# Altium project BytePipe_x9002_HDK_Release_Rev2.PrjPcb (part 1 of 2)
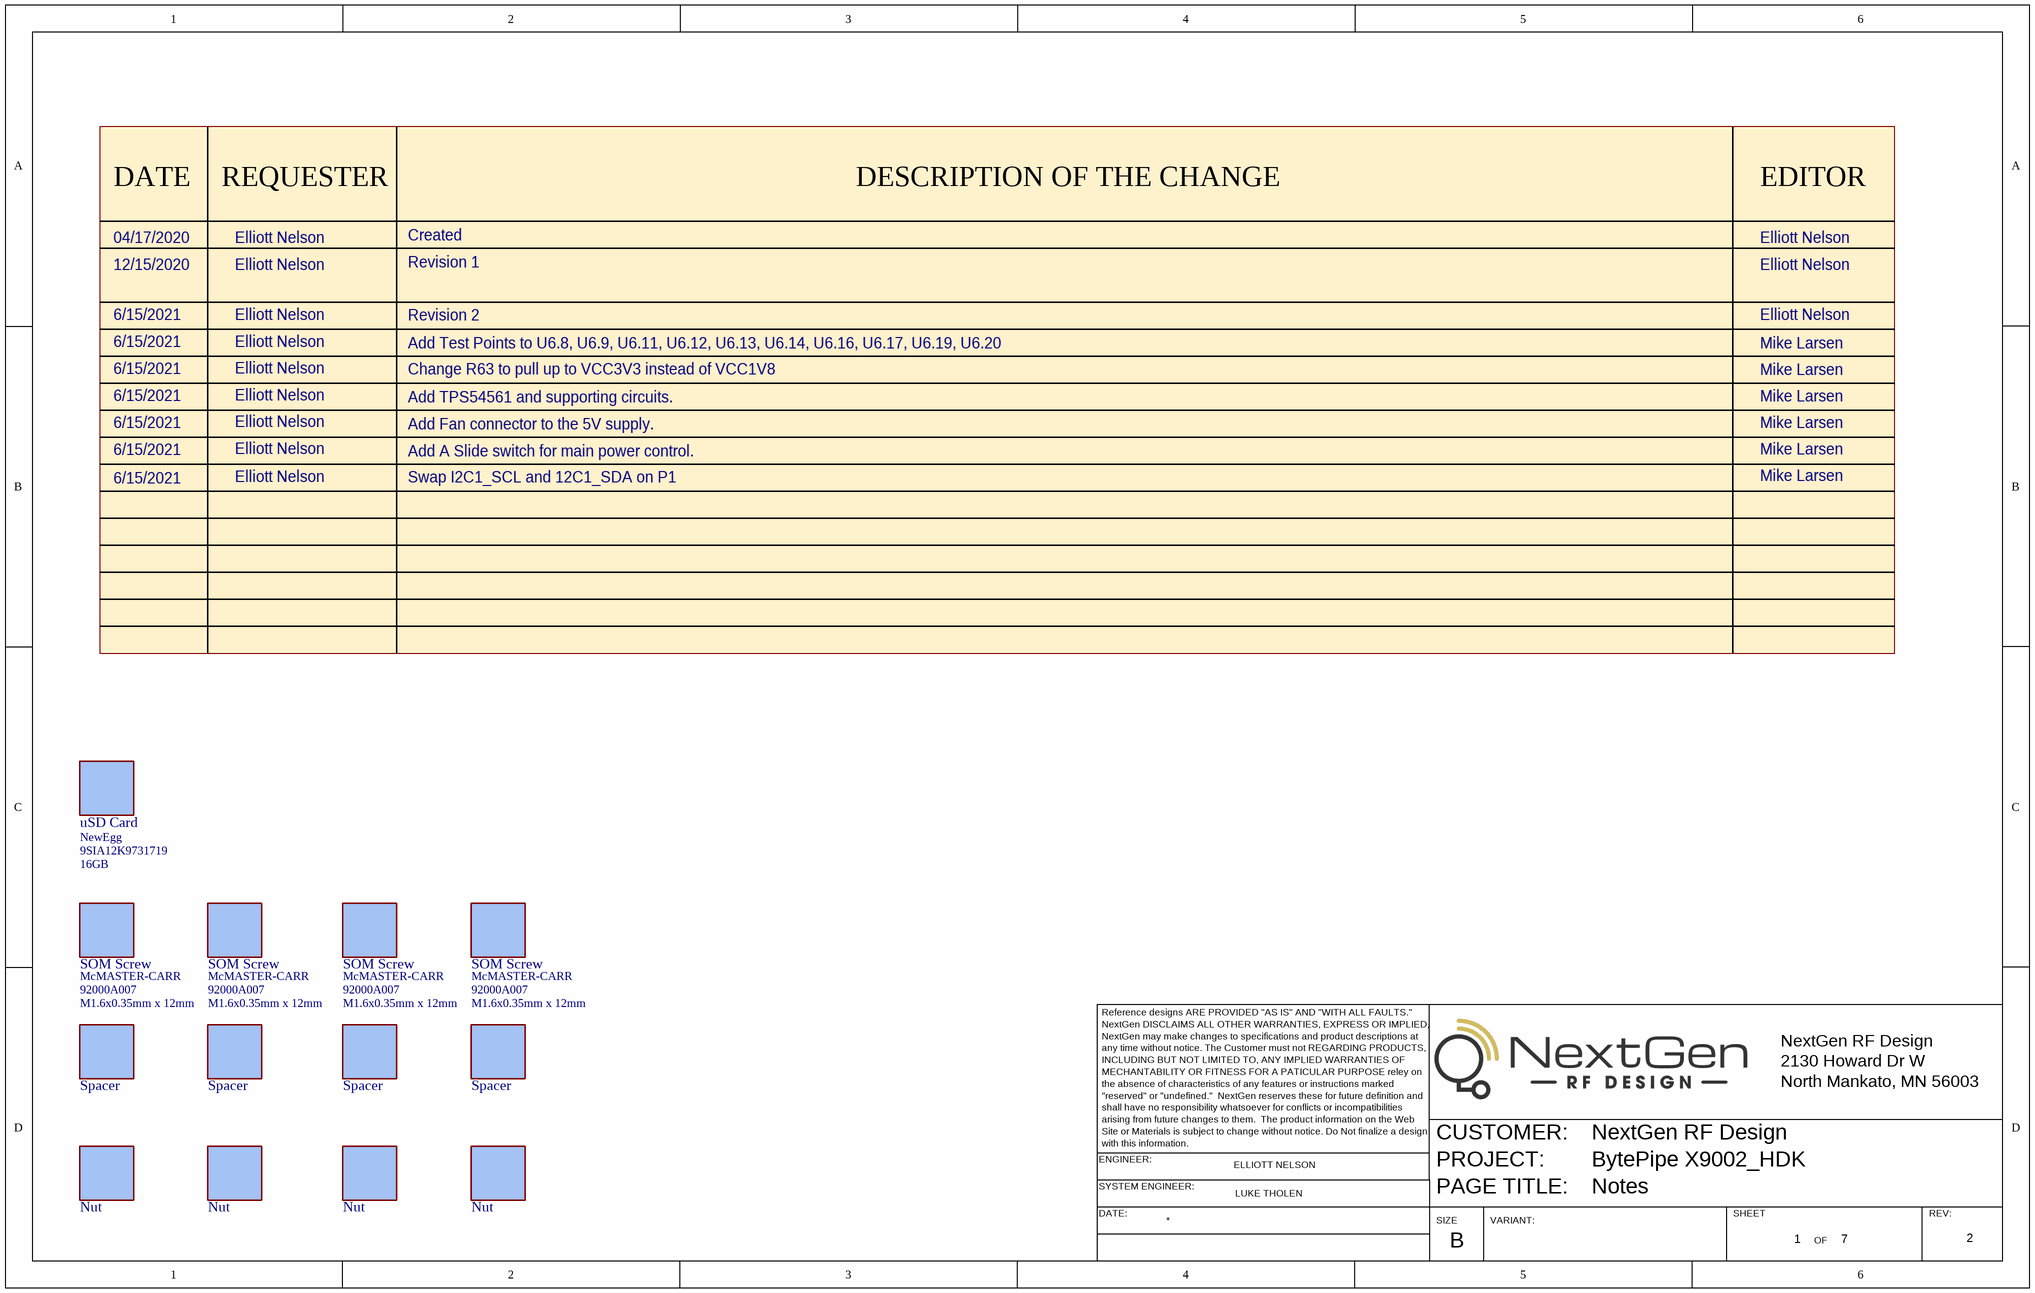
[diagram p0: 1-Notes.SchDoc]
=Engineer: ELLIIOTT NELSON
7 sheets, 318 parts. Net scope: flat (ports and power ports of the same name join across sheets).
Board file: BytePipe_x9002_HDK_Rev2.PcbDoc
Sheets:
  1-Notes.SchDoc
  2-SOM Interface.SchDoc
  3-RF Frontend.SchDoc
  4-USB & SATA.SchDoc
  5-DisplayPort & Ethernet.SchDoc
  6-User IO.SchDoc
  7-JTAG & Power.SchDoc

## Sheet 1-Notes.SchDoc: Notes
size B; CompanyName: NextGen RF Design; Address1: 2130 Howard Drive W; Address2: North Mankato, MN 56003; Address3: www.nextgenrf.com; Revision: 2; SheetNumber: 1; SheetTotal: 7; ProjName: BytePipe X9002_HDK

### Parts
B1  uSD Card  value 16GB  OEM NAME: NewEgg  OEM#: 9SIA12K9731719
B2  SOM Screw  value M1.6x0.35mm x 12mm  OEM NAME: McMASTER-CARR  OEM#: 92000A007
B9  SOM Screw  value M1.6x0.35mm x 12mm  OEM NAME: McMASTER-CARR  OEM#: 92000A007
B10  SOM Screw  value M1.6x0.35mm x 12mm  OEM NAME: McMASTER-CARR  OEM#: 92000A007
B11  SOM Screw  value M1.6x0.35mm x 12mm  OEM NAME: McMASTER-CARR  OEM#: 92000A007
B12  Spacer
B13  Spacer
B14  Spacer
B15  Spacer
B20  Nut
B21  Nut
B22  Nut
B23  Nut

### Notes on the sheet
- DATE
- REQUESTER
- Created
- DESCRIPTION OF THE CHANGE
- EDITOR
- 04/17/2020
- 12/15/2020
- Elliott Nelson
- Revision 1
- 6/15/2021
- Add Test Points to U6.8, U6.9, U6.11, U6.12, U6.13, U6.14, U6.16, U6.17, U6.19, U6.20
- Change R63 to pull up to VCC3V3 instead of VCC1V8
- Revision 2
- Mike Larsen
- Add TPS54561 and supporting circuits.
- Add Fan connector to the 5V supply.
- Swap I2C1_SCL and 12C1_SDA on P1
- Add A Slide switch for main power control.
- Reference designs ARE PROVIDED "AS IS" AND "WITH ALL FAULTS."
- NextGen DISCLAIMS ALL OTHER WARRANTIES, EXPRESS OR IMPLIED,
- NextGen may make changes to specifications and product descriptions at
- NextGen RF Design
- any time without notice. The Customer must not REGARDING PRODUCTS,
- INCLUDING BUT NOT LIMITED TO, ANY IMPLIED WARRANTIES OF
- MECHANTABILITY OR FITNESS FOR A PATICULAR PURPOSE reley on
- "reserved" or "undefined."  NextGen reserves these for future definition and
- the absence of characteristics of any features or instructions marked
- shall have no responsibility whatsoever for conflicts or incompatibilities
- 2130 Howard Dr W
- North Mankato, MN 56003
- ENGINEER:
- Site or Materials is subject to change without notice. Do Not finalize a design
- with this information.
- arising from future changes to them.  The product information on the Web
- ELLIOTT NELSON
- CUSTOMER:
- PROJECT:
- SYSTEM ENGINEER:
- DATE:
- LUKE THOLEN
- SIZE
- PAGE TITLE:
- VARIANT:
- SHEET
- OF
- REV:
- B

### Library data of the parts
B1 = BOM_COMPONENT_NO-FOOTPRINT: 16GB Micro SD Memory Card Class 10 80MB/s Storage Device- BLACK
B2 B9-B15 B20-B23 = BOM_COMPONENT_NO-FOOTPRINT

## Sheet 2-SOM Interface.SchDoc: SOM Interface
size B; CompanyName: NextGen RF Design; Address1: 2130 Howard Drive W; Address2: North Mankato, MN 56003; Address3: www.nextgenrf.com; Revision: 2; SheetNumber: 2; SheetTotal: 7; ProjName: BytePipe X9002_HDK
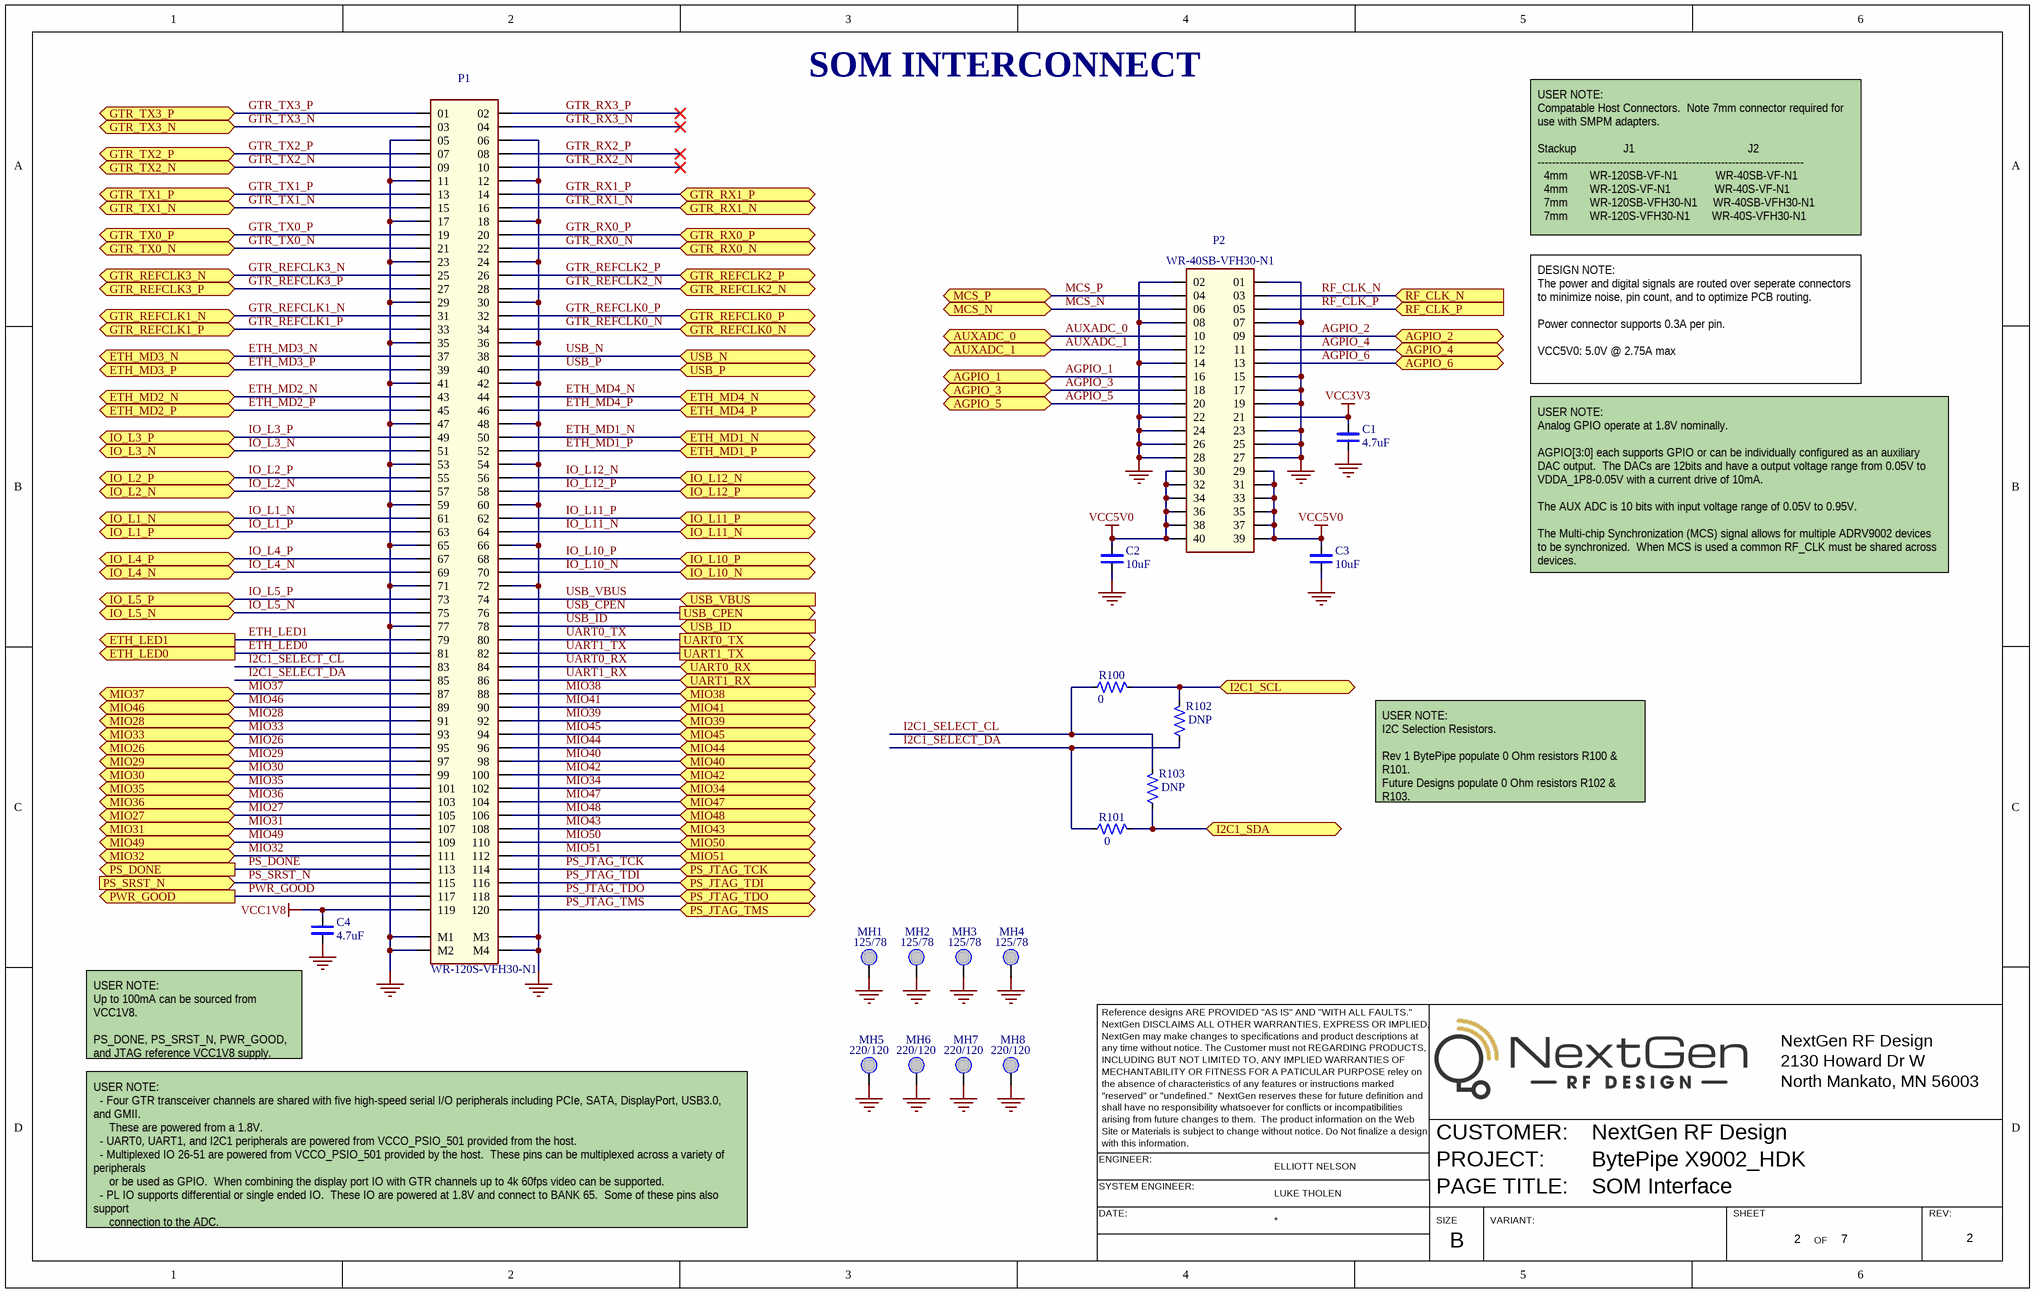
[diagram p1: 2-SOM Interface.SchDoc]

### Parts
C1  value 4.7uF  [SM/0402/CAP]  (hidden comment: CAP_CERAMIC_0402)
C2  value 10uF  [SM/0402/CAP]  (hidden comment: CAP_CERAMIC_0402)
C3  value 10uF  [SM/0402/CAP]  (hidden comment: CAP_CERAMIC_0402)
C4  value 4.7uF  [SM/0402/CAP]  (hidden comment: CAP_CERAMIC_0402)
MH1  HOLE_PTH_125/78  [MTG125/78]  (value not drawn)  (no BOM)
MH2  HOLE_PTH_125/78  [MTG125/78]  (value not drawn)  (no BOM)
MH3  HOLE_PTH_125/78  [MTG125/78]  (value not drawn)  (no BOM)
MH4  HOLE_PTH_125/78  [MTG125/78]  (value not drawn)  (no BOM)
MH5  HOLE_PTH_220/120  [MTG220/120]  (value not drawn)  (no BOM)
MH6  HOLE_PTH_220/120  [MTG220/120]  (value not drawn)  (no BOM)
MH7  HOLE_PTH_220/120  [MTG220/120]  (value not drawn)  (no BOM)
MH8  HOLE_PTH_220/120  [MTG220/120]  (value not drawn)  (no BOM)
P1  value WR-120S-VFH30-N1  [SM/CON/JAE/WR-120S-VFH30-N1]  (hidden comment: WR-120S-VFH30-N1‎)
P2  value WR-40SB-VFH30-N1  [SM/CON/JAE/WR-40SB-VFH30-N1]  (hidden comment: WR-40SB-VFH30-N1‎)
R100  value 0  [SM/0402/RES]  (hidden comment: RES_0402_A)
R101  value 0  [SM/0402/RES]  (hidden comment: RES_0402_A)
R102  value DNP  [SM/0402/RES]  (hidden comment: RES_0402_A)
R103  value DNP  [SM/0402/RES]  (hidden comment: RES_0402_A)

### Ports
AGPIO_1 (bidir), AGPIO_2 (bidir), AGPIO_3 (bidir), AGPIO_4 (bidir), AGPIO_5 (bidir), AGPIO_6 (bidir), AUXADC_0 (bidir), AUXADC_1 (bidir), ETH_LED0 (out), ETH_LED1 (out), ETH_MD1_N (bidir), ETH_MD1_P (bidir), ETH_MD2_N (bidir), ETH_MD2_P (bidir), ETH_MD3_N (bidir), ETH_MD3_P (bidir), ETH_MD4_N (bidir), ETH_MD4_P (bidir), GTR_REFCLK0_N (bidir), GTR_REFCLK0_P (bidir), GTR_REFCLK1_N (bidir), GTR_REFCLK1_P (bidir), GTR_REFCLK2_N (bidir), GTR_REFCLK2_P (bidir), GTR_REFCLK3_N (bidir), GTR_REFCLK3_P (bidir), GTR_RX0_N (bidir), GTR_RX0_P (bidir), GTR_RX1_N (bidir), GTR_RX1_P (bidir), GTR_TX0_N (bidir), GTR_TX0_P (bidir), GTR_TX1_N (bidir), GTR_TX1_P (bidir), GTR_TX2_N (bidir), GTR_TX2_P (bidir), GTR_TX3_N (bidir), GTR_TX3_P (bidir), I2C1_SCL (bidir), I2C1_SDA (bidir), IO_L1_N (bidir), IO_L1_P (bidir), IO_L2_N (bidir), IO_L2_P (bidir), IO_L3_N (bidir), IO_L3_P (bidir), IO_L4_N (bidir), IO_L4_P (bidir), IO_L5_N (bidir), IO_L5_P (bidir), IO_L10_N (bidir), IO_L10_P (bidir), IO_L11_N (bidir), IO_L11_P (bidir), IO_L12_N (bidir), IO_L12_P (bidir), MCS_N (bidir), MCS_P (bidir), MIO26 (bidir), MIO27 (bidir), MIO28 (bidir), MIO29 (bidir), MIO30 (bidir), MIO31 (bidir), MIO32 (bidir), MIO33 (bidir), MIO34 (bidir), MIO35 (bidir), MIO36 (bidir), MIO37 (bidir), MIO38 (bidir), MIO39 (bidir), MIO40 (bidir), MIO41 (bidir), MIO42 (bidir), MIO43 (bidir), MIO44 (bidir), MIO45 (bidir), MIO46 (bidir), MIO47 (bidir), MIO48 (bidir), MIO49 (bidir), MIO50 (bidir), MIO51 (bidir), PS_DONE (out), PS_JTAG_TCK (bidir), PS_JTAG_TDI (bidir), PS_JTAG_TDO (bidir), PS_JTAG_TMS (bidir), PS_SRST_N (in), PWR_GOOD (out), RF_CLK_N (in), RF_CLK_P (in), UART0_RX (in), UART0_TX (out), UART1_RX (in), UART1_TX (out), USB_CPEN (out), USB_ID (in), USB_N (bidir), USB_P (bidir), USB_VBUS (in)

### Nets
GND: C1.2(N2) C2.2(N2) C3.2(N2) C4.2(N2) MH1.1(N1) MH2.1(N1) MH3.1(N1) MH4.1(N1) MH5.1(N1) MH6.1(N1) MH7.1(N1) MH8.1(N1) P1.05 P1.06 P1.11 P1.12 P1.17 P1.18 P1.23 P1.24 P1.29 P1.30 P1.35 P1.36 P1.41 P1.42 P1.47 P1.48 P1.53 P1.54 P1.59 P1.60 P1.65 P1.66 P1.71 P1.72 P1.77 P1.M1 P1.M2 P1.M3 P1.M4 P2.01 P2.02 P2.07 P2.08 P2.14 P2.15 P2.17 P2.19 P2.22 P2.23 P2.24 P2.25 P2.26 P2.27 P2.28
VCC1V8: C4.1(N1) P1.119
VCC3V3: C1.1(N1) P2.21
VCC5V0: C2.1(N1) C3.1(N1) P2.29 P2.30 P2.31 P2.32 P2.33 P2.34 P2.35 P2.36 P2.37 P2.38 P2.39 P2.40
AGPIO_1: P2.16 ; port AGPIO_1
AGPIO_2: P2.09 ; port AGPIO_2
AGPIO_3: P2.18 ; port AGPIO_3
AGPIO_4: P2.11 ; port AGPIO_4
AGPIO_5: P2.20 ; port AGPIO_5
AGPIO_6: P2.13 ; port AGPIO_6
AUXADC_0: P2.10 ; port AUXADC_0
AUXADC_1: P2.12 ; port AUXADC_1
ETH_LED0: P1.81 ; port ETH_LED0
ETH_LED1: P1.79 ; port ETH_LED1
ETH_MD1_N: P1.50 ; port ETH_MD1_N
ETH_MD1_P: P1.52 ; port ETH_MD1_P
ETH_MD2_N: P1.43 ; port ETH_MD2_N
ETH_MD2_P: P1.45 ; port ETH_MD2_P
ETH_MD3_N: P1.37 ; port ETH_MD3_N
ETH_MD3_P: P1.39 ; port ETH_MD3_P
ETH_MD4_N: P1.44 ; port ETH_MD4_N
ETH_MD4_P: P1.46 ; port ETH_MD4_P
GTR_REFCLK0_N: P1.34 ; port GTR_REFCLK0_N
GTR_REFCLK0_P: P1.32 ; port GTR_REFCLK0_P
GTR_REFCLK1_N: P1.31 ; port GTR_REFCLK1_N
GTR_REFCLK1_P: P1.33 ; port GTR_REFCLK1_P
GTR_REFCLK2_N: P1.28 ; port GTR_REFCLK2_N
GTR_REFCLK2_P: P1.26 ; port GTR_REFCLK2_P
GTR_REFCLK3_N: P1.25 ; port GTR_REFCLK3_N
GTR_REFCLK3_P: P1.27 ; port GTR_REFCLK3_P
GTR_RX0_N: P1.22 ; port GTR_RX0_N
GTR_RX0_P: P1.20 ; port GTR_RX0_P
GTR_RX1_N: P1.16 ; port GTR_RX1_N
GTR_RX1_P: P1.14 ; port GTR_RX1_P
GTR_RX2_N: P1.10
GTR_RX2_P: P1.08
GTR_RX3_N: P1.04
GTR_RX3_P: P1.02
GTR_TX0_N: P1.21 ; port GTR_TX0_N
GTR_TX0_P: P1.19 ; port GTR_TX0_P
GTR_TX1_N: P1.15 ; port GTR_TX1_N
GTR_TX1_P: P1.13 ; port GTR_TX1_P
GTR_TX2_N: P1.09 ; port GTR_TX2_N
GTR_TX2_P: P1.07 ; port GTR_TX2_P
GTR_TX3_N: P1.03 ; port GTR_TX3_N
GTR_TX3_P: P1.01 ; port GTR_TX3_P
I2C1_SCL: R100.1 R102.1 ; port I2C1_SCL
I2C1_SDA: R101.1 R103.2 ; port I2C1_SDA
I2C1_SELECT_CL: P1.83 R100.2 R103.1
I2C1_SELECT_DA: P1.85 R101.2 R102.2
IO_L1_N: P1.61 ; port IO_L1_N
IO_L1_P: P1.63 ; port IO_L1_P
IO_L2_N: P1.57 ; port IO_L2_N
IO_L2_P: P1.55 ; port IO_L2_P
IO_L3_N: P1.51 ; port IO_L3_N
IO_L3_P: P1.49 ; port IO_L3_P
IO_L4_N: P1.69 ; port IO_L4_N
IO_L4_P: P1.67 ; port IO_L4_P
IO_L5_N: P1.75 ; port IO_L5_N
IO_L5_P: P1.73 ; port IO_L5_P
IO_L10_N: P1.70 ; port IO_L10_N
IO_L10_P: P1.68 ; port IO_L10_P
IO_L11_N: P1.64 ; port IO_L11_N
IO_L11_P: P1.62 ; port IO_L11_P
IO_L12_N: P1.56 ; port IO_L12_N
IO_L12_P: P1.58 ; port IO_L12_P
MCS_N: P2.06 ; port MCS_N
MCS_P: P2.04 ; port MCS_P
MIO26: P1.95 ; port MIO26
MIO27: P1.105 ; port MIO27
MIO28: P1.91 ; port MIO28
MIO29: P1.97 ; port MIO29
MIO30: P1.99 ; port MIO30
MIO31: P1.107 ; port MIO31
MIO32: P1.111 ; port MIO32
MIO33: P1.93 ; port MIO33
MIO34: P1.102 ; port MIO34
MIO35: P1.101 ; port MIO35
MIO36: P1.103 ; port MIO36
MIO37: P1.87 ; port MIO37
MIO38: P1.88 ; port MIO38
MIO39: P1.92 ; port MIO39
MIO40: P1.98 ; port MIO40
MIO41: P1.90 ; port MIO41
MIO42: P1.100 ; port MIO42
MIO43: P1.108 ; port MIO43
MIO44: P1.96 ; port MIO44
MIO45: P1.94 ; port MIO45
MIO46: P1.89 ; port MIO46
MIO47: P1.104 ; port MIO47
MIO48: P1.106 ; port MIO48
MIO49: P1.109 ; port MIO49
MIO50: P1.110 ; port MIO50
MIO51: P1.112 ; port MIO51
PS_DONE: P1.113 ; port PS_DONE
PS_JTAG_TCK: P1.114 ; port PS_JTAG_TCK
PS_JTAG_TDI: P1.116 ; port PS_JTAG_TDI
PS_JTAG_TDO: P1.118 ; port PS_JTAG_TDO
PS_JTAG_TMS: P1.120 ; port PS_JTAG_TMS
PS_SRST_N: P1.115 ; port PS_SRST_N
PWR_GOOD: P1.117 ; port PWR_GOOD
RF_CLK_N: P2.03 ; port RF_CLK_N
RF_CLK_P: P2.05 ; port RF_CLK_P
UART0_RX: P1.84 ; port UART0_RX
UART0_TX: P1.80 ; port UART0_TX
UART1_RX: P1.86 ; port UART1_RX
UART1_TX: P1.82 ; port UART1_TX
USB_CPEN: P1.76 ; port USB_CPEN
USB_ID: P1.78 ; port USB_ID
USB_N: P1.38 ; port USB_N
USB_P: P1.40 ; port USB_P
USB_VBUS: P1.74 ; port USB_VBUS

### Notes on the sheet
- SOM INTERCONNECT
- USER NOTE:
  Compatable Host Connectors.  Note 7mm connector required for use with SMPM adapters.
  Stackup               J1                                    J2
  --------------------------------------------------------------------------
  4mm       WR-120SB-VF-N1            WR-40SB-VF-N1
  4mm       WR-120S-VF-N1              WR-40S-VF-N1
  7mm       WR-120SB-VFH30-N1     WR-40SB-VFH30-N1
  7mm       WR-120S-VFH30-N1       WR-40S-VFH30-N1
- DESIGN NOTE:
  The power and digital signals are routed over seperate connectors to minimize noise, pin count, and to optimize PCB routing.
  Power connector supports 0.3A per pin.
  VCC5V0: 5.0V @ 2.75A max
- USER NOTE:
  Analog GPIO operate at 1.8V nominally.
  AGPIO[3:0] each supports GPIO or can be individually configured as an auxiliary DAC output.  The DACs are 12bits and have a output voltage range from 0.05V to VDDA_1P8-0.05V with a current drive of 10mA.
  The AUX ADC is 10 bits with input voltage range of 0.05V to 0.95V.
  The Multi-chip Synchronization (MCS) signal allows for multiple ADRV9002 devices to be synchronized.  When MCS is used a common RF_CLK must be shared across devices.
- USER NOTE:
  I2C Selection Resistors.
  Rev 1 BytePipe populate 0 Ohm resistors R100 & R101.
  Future Designs populate 0 Ohm resistors R102 & R103.
- Reference designs ARE PROVIDED "AS IS" AND "WITH ALL FAULTS."
- NextGen DISCLAIMS ALL OTHER WARRANTIES, EXPRESS OR IMPLIED,
- NextGen may make changes to specifications and product descriptions at
- NextGen RF Design
- (near C4) USER NOTE:
  Up to 100mA can be sourced from VCC1V8.
  PS_DONE, PS_SRST_N, PWR_GOOD, and JTAG reference VCC1V8 supply.
- any time without notice. The Customer must not REGARDING PRODUCTS,
- INCLUDING BUT NOT LIMITED TO, ANY IMPLIED WARRANTIES OF
- MECHANTABILITY OR FITNESS FOR A PATICULAR PURPOSE reley on
- "reserved" or "undefined."  NextGen reserves these for future definition and
- the absence of characteristics of any features or instructions marked
- shall have no responsibility whatsoever for conflicts or incompatibilities
- 2130 Howard Dr W
- North Mankato, MN 56003
- ENGINEER:
- Site or Materials is subject to change without notice. Do Not finalize a design
- with this information.
- arising from future changes to them.  The product information on the Web
- ELLIOTT NELSON
- CUSTOMER:
- PROJECT:
- USER NOTE:
  - Four GTR transceiver channels are shared with five high-speed serial I/O peripherals including PCIe, SATA, DisplayPort, USB3.0, and GMII.
  These are powered from a 1.8V.
  - UART0, UART1, and I2C1 peripherals are powered from VCCO_PSIO_501 provided from the host.
  - Multiplexed IO 26-51 are powered from VCCO_PSIO_501 provided by the host.  These pins can be multiplexed across a variety of peripherals
  or be used as GPIO.  When combining the display port IO with GTR channels up to 4k 60fps video can be supported.
  - PL IO supports differential or single ended IO.  These IO are powered at 1.8V and connect to BANK 65.  Some of these pins also support
  connection to the ADC.
  - USB OTG signals support USB2.0 host or device.  They can be combined with GTR channels to support USB 3.0.
- SYSTEM ENGINEER:
- DATE:
- LUKE THOLEN
- SIZE
- PAGE TITLE:
- VARIANT:
- SHEET
- OF
- REV:
- B
- (in symbol HOLE_PTH_125/78) 125/78
- (in symbol HOLE_PTH_220/120) 220/120

### Library data of the parts
C1 C4 = CAP_CERAMIC_0402: CAP CER 4.7UF 10V X5R 0402; TOL: ±20%; OEM#: CL05A475MP5NRNC; OEM NAME: Samsung; VOLT: 10V
C2 C3 = CAP_CERAMIC_0402: 10µF ±20% 10V Ceramic Capacitor X5R 0402 (1005 Metric); OEM#: CL05A106MP8NUB8; OEM NAME: Samsung; TOL: ±20%; VOLT: 10V
MH1-MH4 = HOLE_PTH_125/78: 125 mil pad / 78 mil hole
MH5-MH8 = HOLE_PTH_220/120: 220 mil pad / 120 mil hole (#4 Pan Head Screw)
P1 = CON_JAE_WR-120S-VFH30-N1: 0.5 mm pitch, 120 Position Connector Receptacle, Center Strip Contacts Surface Mount Gold.; OEM NAME: JAE; OEM#: WR-120S-VFH30-N1
P2 = CON_JAE_WR-40SB-VFH30-N1: 0.5 mm pitch, 40 Position Connector Receptacle, Center Strip Contacts Surface Mount Gold, with Alignment Pins.; OEM NAME: JAE; OEM#: WR-40SB-VFH30-N1
R100 R101 = RES_0402_A: RES SMD 0 OHM JUMPER 1/10W 0402; OEM#: ERJ-2GE0R00X; OEM NAME: Panasonic; TOL: 1%
R102 R103 = RES_0402_A: DNP; OEM#: DNP

## Sheet 3-RF Frontend.SchDoc: RF Frontend
size B; CompanyName: NGRF; Address1: 2130 Howard Drive W; Address2: North Mankato, MN 56003; Address3: www.nextgenrf.com; Revision: 2; SheetNumber: 3; SheetTotal: 7; ProjName: BytePipe X9002_HDK
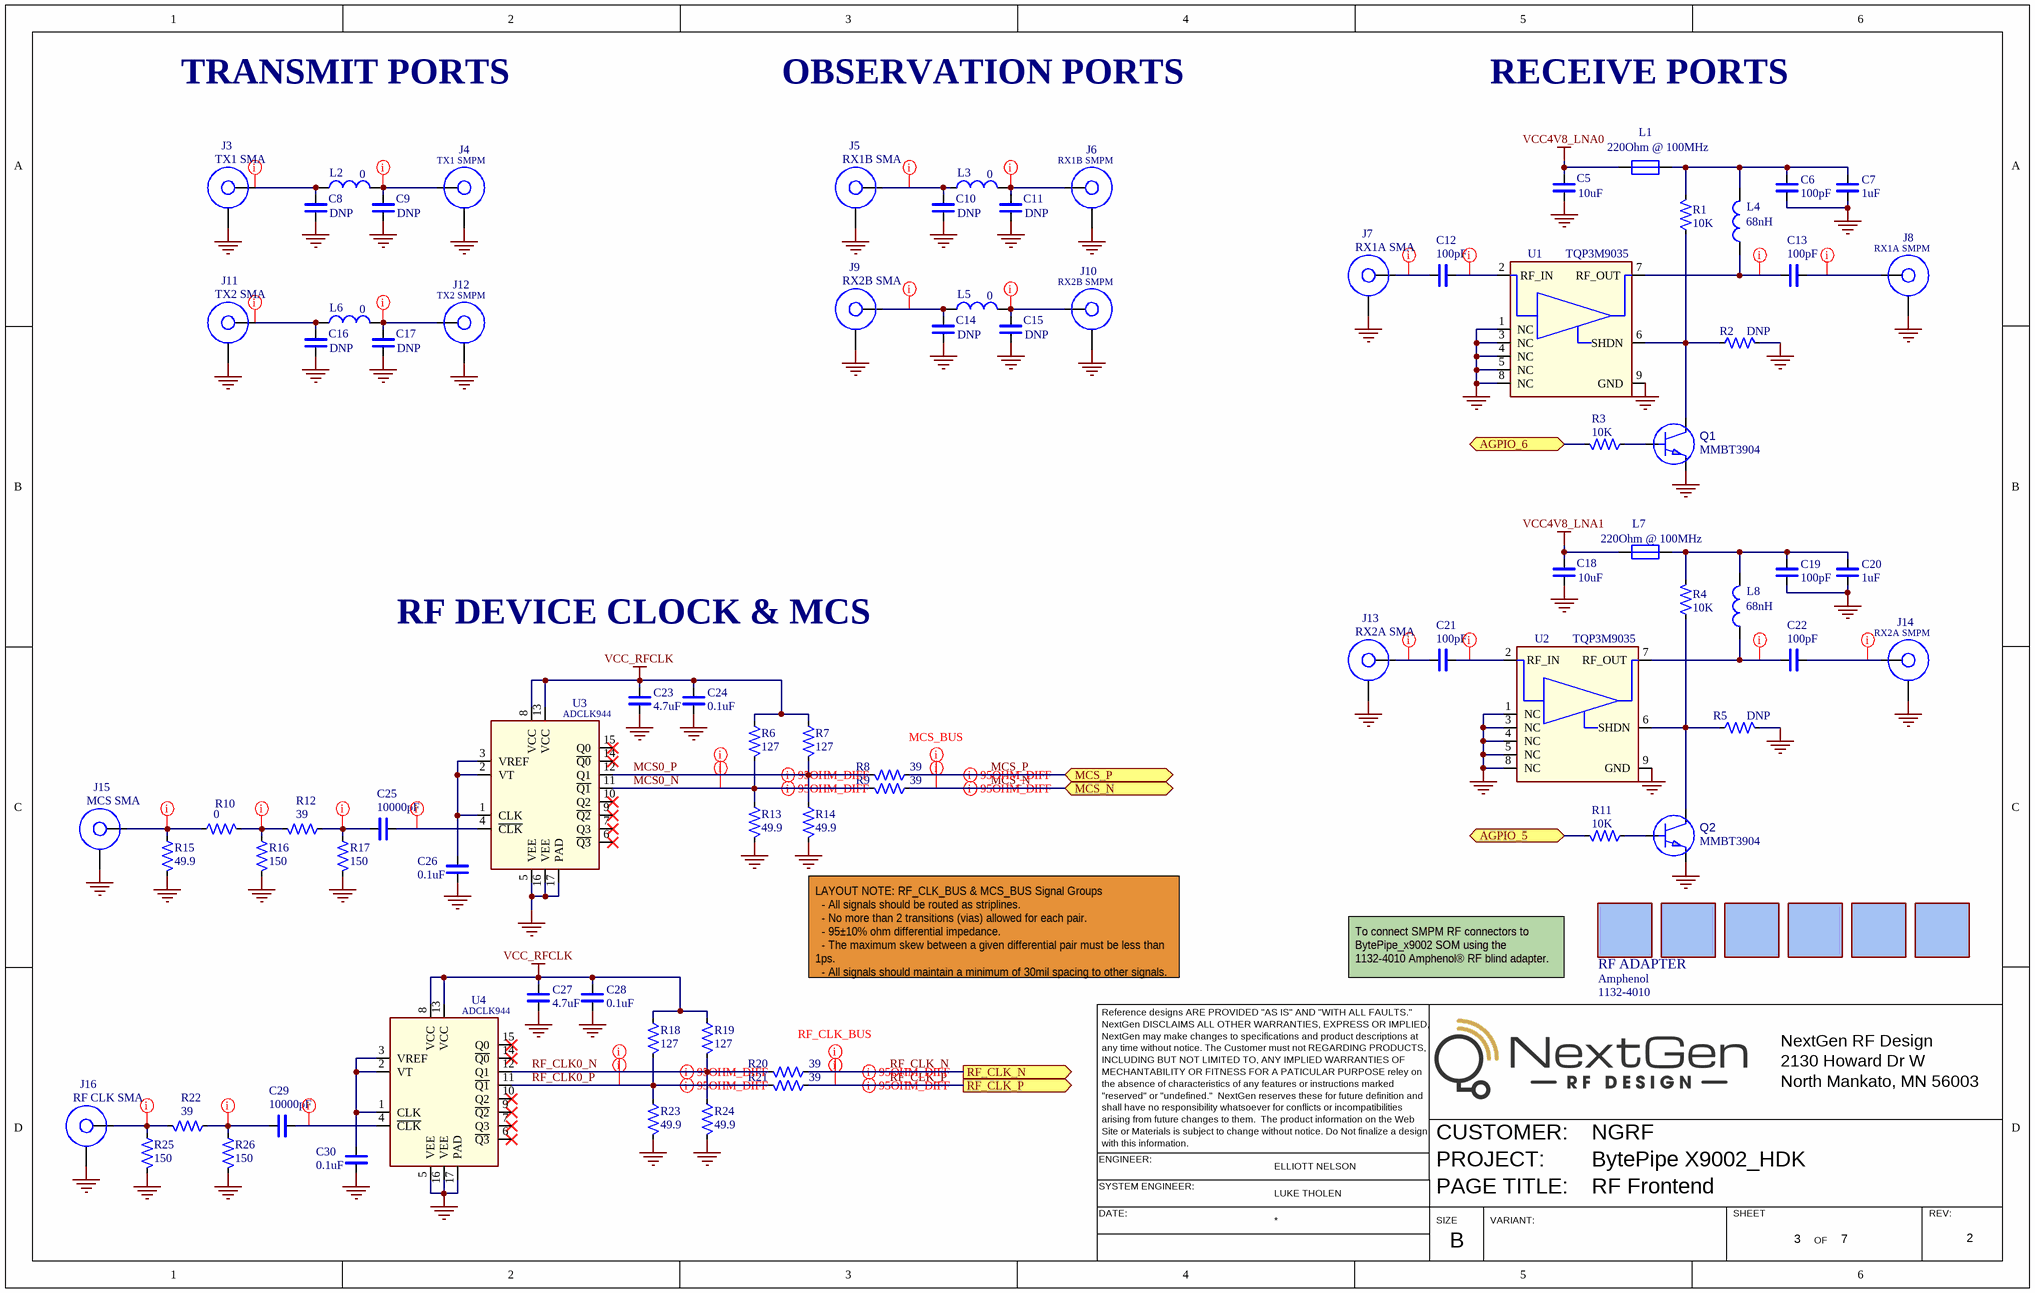
[diagram p2: 3-RF Frontend.SchDoc]

### Parts
B3  RF ADAPTER  OEM NAME: Amphenol  OEM#: 1132-4010
B4  RF ADAPTER  (value not drawn)
B5  RF ADAPTER  (value not drawn)
B6  RF ADAPTER  (value not drawn)
B7  RF ADAPTER  (value not drawn)
B8  RF ADAPTER  (value not drawn)
C5  value 10uF  [SM/0402/CAP]  (hidden comment: CAP_CERAMIC_0402)
C6  value 100pF  [SM/0402/CAP]  (hidden comment: CAP_CERAMIC_0402)
C7  value 1uF  [SM/0402/CAP]  (hidden comment: CAP_CERAMIC_0402)
C8  value DNP  [SM/0402/CAP]  (hidden comment: CAP_CERAMIC_0402)
C9  value DNP  [SM/0402/CAP]  (hidden comment: CAP_CERAMIC_0402)
C10  value DNP  [SM/0402/CAP]  (hidden comment: CAP_CERAMIC_0402)
C11  value DNP  [SM/0402/CAP]  (hidden comment: CAP_CERAMIC_0402)
C12  value 100pF  [SM/0402/CAP]  (hidden comment: CAP_CERAMIC_0402)
C13  value 100pF  [SM/0402/CAP]  (hidden comment: CAP_CERAMIC_0402)
C14  value DNP  [SM/0402/CAP]  (hidden comment: CAP_CERAMIC_0402)
C15  value DNP  [SM/0402/CAP]  (hidden comment: CAP_CERAMIC_0402)
C16  value DNP  [SM/0402/CAP]  (hidden comment: CAP_CERAMIC_0402)
C17  value DNP  [SM/0402/CAP]  (hidden comment: CAP_CERAMIC_0402)
C18  value 10uF  [SM/0402/CAP]  (hidden comment: CAP_CERAMIC_0402)
C19  value 100pF  [SM/0402/CAP]  (hidden comment: CAP_CERAMIC_0402)
C20  value 1uF  [SM/0402/CAP]  (hidden comment: CAP_CERAMIC_0402)
C21  value 100pF  [SM/0402/CAP]  (hidden comment: CAP_CERAMIC_0402)
C22  value 100pF  [SM/0402/CAP]  (hidden comment: CAP_CERAMIC_0402)
C23  value 4.7uF  [SM/0402/CAP]  (hidden comment: CAP_CERAMIC_0402)
C24  value 0.1uF  [SM/0402/CAP]  (hidden comment: CAP_CERAMIC_0402)
C25  value 10000pF  [SM/0402/CAP]  (hidden comment: CAP_CERAMIC_0402)
C26  value 0.1uF  [SM/0402/CAP]  (hidden comment: CAP_CERAMIC_0402)
C27  value 4.7uF  [SM/0402/CAP]  (hidden comment: CAP_CERAMIC_0402)
C28  value 0.1uF  [SM/0402/CAP]  (hidden comment: CAP_CERAMIC_0402)
C29  value 10000pF  [SM/0402/CAP]  (hidden comment: CAP_CERAMIC_0402)
C30  value 0.1uF  [SM/0402/CAP]  (hidden comment: CAP_CERAMIC_0402)
J3  value TX1 SMA  [SM/CON/RF/SMA/BRD-EDGE_C]  (hidden comment: CON_RF_SMA_BRD-EDGE_C)
J4  value TX1 SMPM  [SM/CON/RF/SMPM/VERT_A]  (hidden comment: CON_RF_SMPM_SMT_AMPHENOL)
J5  value RX1B SMA  [SM/CON/RF/SMA/BRD-EDGE_C]  (hidden comment: CON_RF_SMA_BRD-EDGE_C)
J6  value RX1B SMPM  [SM/CON/RF/SMPM/VERT_A]  (hidden comment: CON_RF_SMPM_SMT_AMPHENOL)
J7  value RX1A SMA  [SM/CON/RF/SMA/BRD-EDGE_C]  (hidden comment: CON_RF_SMA_BRD-EDGE_C)
J8  value RX1A SMPM  [SM/CON/RF/SMPM/VERT_A]  (hidden comment: CON_RF_SMPM_SMT_AMPHENOL)
J9  value RX2B SMA  [SM/CON/RF/SMA/BRD-EDGE_C]  (hidden comment: CON_RF_SMA_BRD-EDGE_C)
J10  value RX2B SMPM  [SM/CON/RF/SMPM/VERT_A]  (hidden comment: CON_RF_SMPM_SMT_AMPHENOL)
J11  value TX2 SMA  [SM/CON/RF/SMA/BRD-EDGE_C]  (hidden comment: CON_RF_SMA_BRD-EDGE_C)
J12  value TX2 SMPM  [SM/CON/RF/SMPM/VERT_A]  (hidden comment: CON_RF_SMPM_SMT_AMPHENOL)
J13  value RX2A SMA  [SM/CON/RF/SMA/BRD-EDGE_C]  (hidden comment: CON_RF_SMA_BRD-EDGE_C)
J14  value RX2A SMPM  [SM/CON/RF/SMPM/VERT_A]  (hidden comment: CON_RF_SMPM_SMT_AMPHENOL)
J15  value MCS SMA  [SM/CON/RF/SMA/BRD-EDGE_C]  (hidden comment: CON_RF_SMA_BRD-EDGE_C)
J16  value RF CLK SMA  [SM/CON/RF/SMA/BRD-EDGE_C]  (hidden comment: CON_RF_SMA_BRD-EDGE_C)
L1  value 220Ohm @ 100MHz  [SM/0603]  (hidden comment: FERRITE_0603_A)
L2  value 0  [SM/0402]  (hidden comment: IND_0402)
L3  value 0  [SM/0402]  (hidden comment: IND_0402)
L4  value 68nH  [SM/0603]  (hidden comment: IND_0603)
L5  value 0  [SM/0402]  (hidden comment: IND_0402)
L6  value 0  [SM/0402]  (hidden comment: IND_0402)
L7  value 220Ohm @ 100MHz  [SM/0603]  (hidden comment: FERRITE_0603_A)
L8  value 68nH  [SM/0603]  (hidden comment: IND_0603)
Q1  value MMBT3904  [SM/SOT23_A]  (hidden comment: TRANSISTOR_NPN_SOT23)
Q2  value MMBT3904  [SM/SOT23_A]  (hidden comment: TRANSISTOR_NPN_SOT23)
R1  value 10K  [SM/0402/RES]  (hidden comment: RES_0402_A)
R2  value DNP  [SM/0402/RES]  (hidden comment: RES_0402_A)
R3  value 10K  [SM/0402/RES]  (hidden comment: RES_0402_A)
R4  value 10K  [SM/0402/RES]  (hidden comment: RES_0402_A)
R5  value DNP  [SM/0402/RES]  (hidden comment: RES_0402_A)
R6  value 127  [SM/0402/RES]  (hidden comment: RES_0402_A)
R7  value 127  [SM/0402/RES]  (hidden comment: RES_0402_A)
R8  value 39  [SM/0402/RES]  (hidden comment: RES_0402_A)
R9  value 39  [SM/0402/RES]  (hidden comment: RES_0402_A)
R10  value 0  [SM/0402/RES]  (hidden comment: RES_0402_A)
R11  value 10K  [SM/0402/RES]  (hidden comment: RES_0402_A)
R12  value 39  [SM/0402/RES]  (hidden comment: RES_0402_A)
R13  value 49.9  [SM/0402/RES]  (hidden comment: RES_0402_A)
R14  value 49.9  [SM/0402/RES]  (hidden comment: RES_0402_A)
R15  value 49.9  [SM/0402/RES]  (hidden comment: RES_0402_A)
R16  value 150  [SM/0402/RES]  (hidden comment: RES_0402_A)
R17  value 150  [SM/0402/RES]  (hidden comment: RES_0402_A)
R18  value 127  [SM/0402/RES]  (hidden comment: RES_0402_A)
R19  value 127  [SM/0402/RES]  (hidden comment: RES_0402_A)
R20  value 39  [SM/0402/RES]  (hidden comment: RES_0402_A)
R21  value 39  [SM/0402/RES]  (hidden comment: RES_0402_A)
R22  value 39  [SM/0402/RES]  (hidden comment: RES_0402_A)
R23  value 49.9  [SM/0402/RES]  (hidden comment: RES_0402_A)
R24  value 49.9  [SM/0402/RES]  (hidden comment: RES_0402_A)
R25  value 150  [SM/0402/RES]  (hidden comment: RES_0402_A)
R26  value 150  [SM/0402/RES]  (hidden comment: RES_0402_A)
U1  value TQP3M9035  [SM/DFN8/2X2MM_E]  (hidden comment: IC_TQP3M9035_DFN-8)
U2  value TQP3M9035  [SM/DFN8/2X2MM_E]  (hidden comment: IC_TQP3M9035_DFN-8)
U3  value ADCLK944  [SM/QFN16/3X3/0.5LS_A]  (hidden comment: IC_ADCLK944_QFN16)
U4  value ADCLK944  [SM/QFN16/3X3/0.5LS_A]  (hidden comment: IC_ADCLK944_QFN16)

### Ports
AGPIO_5 (bidir), AGPIO_6 (bidir), MCS_N (bidir), MCS_P (bidir), RF_CLK_N (out), RF_CLK_P (out)

### Nets
GND: C5.2(N2) C6.2(N2) C7.2(N2) C8.2(N2) C9.2(N2) C10.2(N2) C11.2(N2) C14.2(N2) C15.2(N2) C16.2(N2) C17.2(N2) C18.2(N2) C19.2(N2) C20.2(N2) C23.2(N2) C24.2(N2) C26.2(N2) C27.2(N2) C28.2(N2) C30.2(N2) J3.2 J4.2 J5.2 J6.2 J7.2 J8.2 J9.2 J10.2 J11.2 J12.2 J13.2 J14.2 J15.2 J16.2 Q1.2(E) Q2.2(E) R2.1 R5.1 R13.2 R14.2 R15.2 R16.2 R17.2 R23.2 R24.2 R25.2 R26.2 U1.1(NC) U1.3(NC) U1.4(NC) U1.5(NC) U1.8(NC) U1.9(GND) U2.1(NC) U2.3(NC) U2.4(NC) U2.5(NC) U2.8(NC) U2.9(GND) U3.5(VEE) U3.16(VEE) U3.17(PAD) U4.5(VEE) U4.16(VEE) U4.17(PAD)
VCC4V8_LNA0: C5.1(N1) L1.1(PIN1)
VCC4V8_LNA1: C18.1(N1) L7.1(PIN1)
VCC_RFCLK: C23.1(N1) C24.1(N1) C27.1(N1) C28.1(N1) R6.1 R7.1 R18.1 R19.1 U3.8(VCC) U3.13(VCC) U4.8(VCC) U4.13(VCC)
AGPIO_5: R11.1 ; port AGPIO_5
AGPIO_6: R3.1 ; port AGPIO_6
MCS0_N: R6.2 R9.2 R13.1 U3.11(~{Q1})
MCS0_P: R7.2 R8.2 R14.1 U3.12(Q1)
MCS_N: R9.1 ; port MCS_N
MCS_P: R8.1 ; port MCS_P
RF_CLK0_N: R19.2 R20.2 R24.1 U4.12(Q1)
RF_CLK0_P: R18.2 R21.2 R23.1 U4.11(~{Q1})
RF_CLK_N: R20.1 ; port RF_CLK_N
RF_CLK_P: R21.1 ; port RF_CLK_P
NetC6_1: C6.1(N1) C7.1(N1) L1.2(PIN2) L4.2(PIN2) R1.1
NetC8_1: C8.1(N1) J3.1 L2.1(PIN1)
NetC9_1: C9.1(N1) J4.1 L2.2(PIN2)
NetC10_1: C10.1(N1) J5.1 L3.1(PIN1)
NetC11_1: C11.1(N1) J6.1 L3.2(PIN2)
NetC12_1: C12.1(N1) J7.1
NetC12_2: C12.2(N2) U1.2(RF_IN)
NetC13_1: C13.1(N1) L4.1(PIN1) U1.7(RF_OUT)
NetC13_2: C13.2(N2) J8.1
NetC14_1: C14.1(N1) J9.1 L5.1(PIN1)
NetC15_1: C15.1(N1) J10.1 L5.2(PIN2)
NetC16_1: C16.1(N1) J11.1 L6.1(PIN1)
NetC17_1: C17.1(N1) J12.1 L6.2(PIN2)
NetC19_1: C19.1(N1) C20.1(N1) L7.2(PIN2) L8.2(PIN2) R4.1
NetC21_1: C21.1(N1) J13.1
NetC21_2: C21.2(N2) U2.2(RF_IN)
NetC22_1: C22.1(N1) L8.1(PIN1) U2.7(RF_OUT)
NetC22_2: C22.2(N2) J14.1
NetC25_1: C25.1(N1) R12.1 R17.1
NetC25_2: C25.2(N2) U3.4(~{CLK})
NetC26_1: C26.1(N1) U3.1(CLK) U3.2(VT) U3.3(VREF)
NetC29_1: C29.1(N1) R22.1 R26.1
NetC29_2: C29.2(N2) U4.4(~{CLK})
NetC30_1: C30.1(N1) U4.1(CLK) U4.2(VT) U4.3(VREF)
NetJ15_1: J15.1 R10.2 R15.1
NetJ16_1: J16.1 R22.2 R25.1
NetQ1_1: Q1.1(B) R3.2
NetQ1_3: Q1.3(C) R1.2 R2.2 U1.6(SHDN)
NetQ2_1: Q2.1(B) R11.2
NetQ2_3: Q2.3(C) R4.2 R5.2 U2.6(SHDN)
NetR10_1: R10.1 R12.2 R16.1

Not connected (* = marked no-connect by the designer): U3 6(~{Q3})* 7(Q3)* 9(~{Q2})* 10(Q2)* 14(~{Q0})* 15(Q0)*; U4 6(~{Q3})* 7(Q3)* 9(~{Q2})* 10(Q2)* 14(~{Q0})* 15(Q0)*

### Layout directives
net class 50OHM_SE: NetC8_1, NetC9_1, NetC10_1, NetC11_1, NetC12_1, NetC12_2, NetC13_1, NetC13_2, NetC14_1, NetC15_1, NetC16_1, NetC17_1, NetC21_1, NetC21_2, NetC22_1, NetC22_2, NetC25_1, NetC25_2, NetC29_1, NetC29_2, NetJ15_1, NetJ16_1, NetR10_1
differential pair; Impedance: 90 Ohms; differential pair class 95OHM_DIFF: MCS0_N, MCS0_P, MCS_N, MCS_P, RF_CLK0_N, RF_CLK0_P, RF_CLK_N, RF_CLK_P
net class RF_CLK_BUS: RF_CLK0_N, RF_CLK0_P, RF_CLK_N, RF_CLK_P
net class MCS_BUS: MCS0_N, MCS0_P, MCS_N, MCS_P

### Notes on the sheet
- TRANSMIT PORTS
- OBSERVATION PORTS
- RECEIVE PORTS
- RF DEVICE CLOCK & MCS
- (near R14) LAYOUT NOTE: RF_CLK_BUS & MCS_BUS Signal Groups
  - All signals should be routed as striplines.
  - No more than 2 transitions (vias) allowed for each pair.
  - 95±10% ohm differential impedance.
  - The maximum skew between a given differential pair must be less than 1ps.
  - All signals should maintain a minimum of 30mil spacing to other signals.
- (near B3) To connect SMPM RF connectors to BytePipe_x9002 SOM using the 1132-4010 Amphenol® RF blind adapter.
- Reference designs ARE PROVIDED "AS IS" AND "WITH ALL FAULTS."
- NextGen DISCLAIMS ALL OTHER WARRANTIES, EXPRESS OR IMPLIED,
- NextGen may make changes to specifications and product descriptions at
- NextGen RF Design
- any time without notice. The Customer must not REGARDING PRODUCTS,
- INCLUDING BUT NOT LIMITED TO, ANY IMPLIED WARRANTIES OF
- MECHANTABILITY OR FITNESS FOR A PATICULAR PURPOSE reley on
- "reserved" or "undefined."  NextGen reserves these for future definition and
- the absence of characteristics of any features or instructions marked
- shall have no responsibility whatsoever for conflicts or incompatibilities
- 2130 Howard Dr W
- North Mankato, MN 56003
- ENGINEER:
- Site or Materials is subject to change without notice. Do Not finalize a design
- with this information.
- arising from future changes to them.  The product information on the Web
- ELLIOTT NELSON
- CUSTOMER:
- PROJECT:
- SYSTEM ENGINEER:
- DATE:
- LUKE THOLEN
- SIZE
- PAGE TITLE:
- VARIANT:
- SHEET
- OF
- REV:
- B

### Library data of the parts
B3 = BOM_COMPONENT_NO-FOOTPRINT: Amphenol® RF SMPM blind adapter; VALUE: RF ADAPTER
B4-B8 = BOM_COMPONENT_NO-FOOTPRINT: Amphenol® RF SMPM blind adapter; OEM#: 1132-4010; OEM NAME: Amphenol; VALUE: RF ADAPTER
C5 C18 = CAP_CERAMIC_0402: as C2 on sheet 2-SOM Interface; TOL: ±20%; VOLT: 10V
C6 C12 C13 C19 C21 C22 = CAP_CERAMIC_0402: CAP CER 100PF 50V C0G/NP0 0402; TOL: ±5%; OEM#: CL05C101JB5NNNC; OEM NAME: Samsung; VOLT: 50V
C7 C20 = CAP_CERAMIC_0402: CAP CER 1UF 16V X5R 0402; TOL: ±10%; OEM#: CL05A105KO5NNNC; OEM NAME: Samsung; VOLT: 16V
C23 C27 = CAP_CERAMIC_0402: as C1 on sheet 2-SOM Interface; VOLT: 10V
C24 C26 C28 C30 = CAP_CERAMIC_0402: CAP CER 0.1UF 25V X7R 0402; TOL: ±10%; OEM#: CL05B104KA5NNNC; OEM NAME: Samsung; VOLT: 25V
C25 C29 = CAP_CERAMIC_0402: CAP CER 10000PF 50V X7R 0402; TOL: ±10%; OEM#: CL05B103KB5VPNC; OEM NAME: Samsung; VOLT: 50V
J3 J5 J7 J9 J11 J13 J15 J16 = CON_RF_SMA_BRD-EDGE_C: SMA board edge style, .250" wide style; OEM#: 142-0711-821; OEM NAME: Cinch
J4 J6 J8 J10 J12 J14 = CON_RF_SMPM_SMT_AMPHENOL: SMPM Connector Plug, Male Pin 50Ohm Surface Mount Solder. Based off of Amphenol 925-144J-51PT; OEM NAME: AMP; OEM#: 925-144J-51PT
L1 L7 = FERRITE_0603_A: 120 Ohms @ 100MHz 1 Power Line Ferrite Bead 0603 (1608 Metric) 3A 25mOhm; OEM#: BLM18SG221TN1D; OEM NAME: Murata Electronics
L2 L3 L5 L6 = IND_0402: RES SMD 0 OHM JUMPER 1/10W 0402; OEM#: ERJ-2GE0R00X; OEM NAME: Panasonic
L4 L8 = IND_0603: FIXED IND 68NH 300MA 800 MOHM; OEM#: LQG18HH68NJ00D; OEM NAME: Murata
Q1 Q2 = TRANSISTOR_NPN_SOT23: Bipolar (BJT) Transistor NPN 40V 200mA 300MHz 300mW Surface Mount SOT-23-3 (TO-236); OEM#: MMBT3904LT1G; OEM NAME: ON Semiconductor
R1 R3 R4 R11 = RES_0402_A: RES SMD 10K OHM 1% 1/10W 0402; OEM#: ERJ-2RKF1002X; OEM NAME: Panasonic; TOL: ±1%
R6 R7 R18 R19 = RES_0402_A: RES SMD 127 OHM 1% 1/10W 0402; OEM#: ERJ-2RKF1270X; OEM NAME: Panasonic; TOL: 1%
R8 R9 R12 R20-R22 = RES_0402_A: RES SMD 39 OHM 1% 1/10W 0402; OEM#: ERJ-2RKF39R0X; OEM NAME: Panasonic; TOL: 1%
R10 = RES_0402_A: as R100 on sheet 2-SOM Interface
R13-R15 R23 R24 = RES_0402_A: RES 49.9 OHM 1% 1/10W 0402; OEM#: ERJ-2RKF49R9X; OEM NAME: Panasonic; TOL: ±1%
R16 R17 R25 R26 = RES_0402_A: RES SMD 150 OHM 1% 1/10W 0402; OEM#: ERJ-2RKF1500X; OEM NAME: Panasonic; TOL: ±1%
U1 U2 = IC_TQP3M9035_DFN-8: RF Amplifier 50-4000MHz NF .66dB Gain 16.5dB @1.9GHz; OEM NAME: Qorvo; OEM#: TQP3M9035
U3 U4 = IC_ADCLK944_QFN16: IC CLK BUFFER 1:4 7GHZ 16LFCSP; OEM#: ADCLK944BCPZ-R2; OEM NAME: ANALOG DEVICES
C8-C11 C14-C17 = CAP_CERAMIC_0402: TOL: *; OEM#: DNP; VOLT: *
R2 R5 = RES_0402_A: OEM#: DNP

## Sheet 4-USB & SATA.SchDoc: USB & SATA
size B; CompanyName: NGRF; Address1: 2130 Howard Drive W; Address2: North Mankato, MN 56003; Address3: www.nextgenrf.com; Revision: 2; SheetNumber: 4; SheetTotal: 7; ProjName: BytePipe X9002_HDK
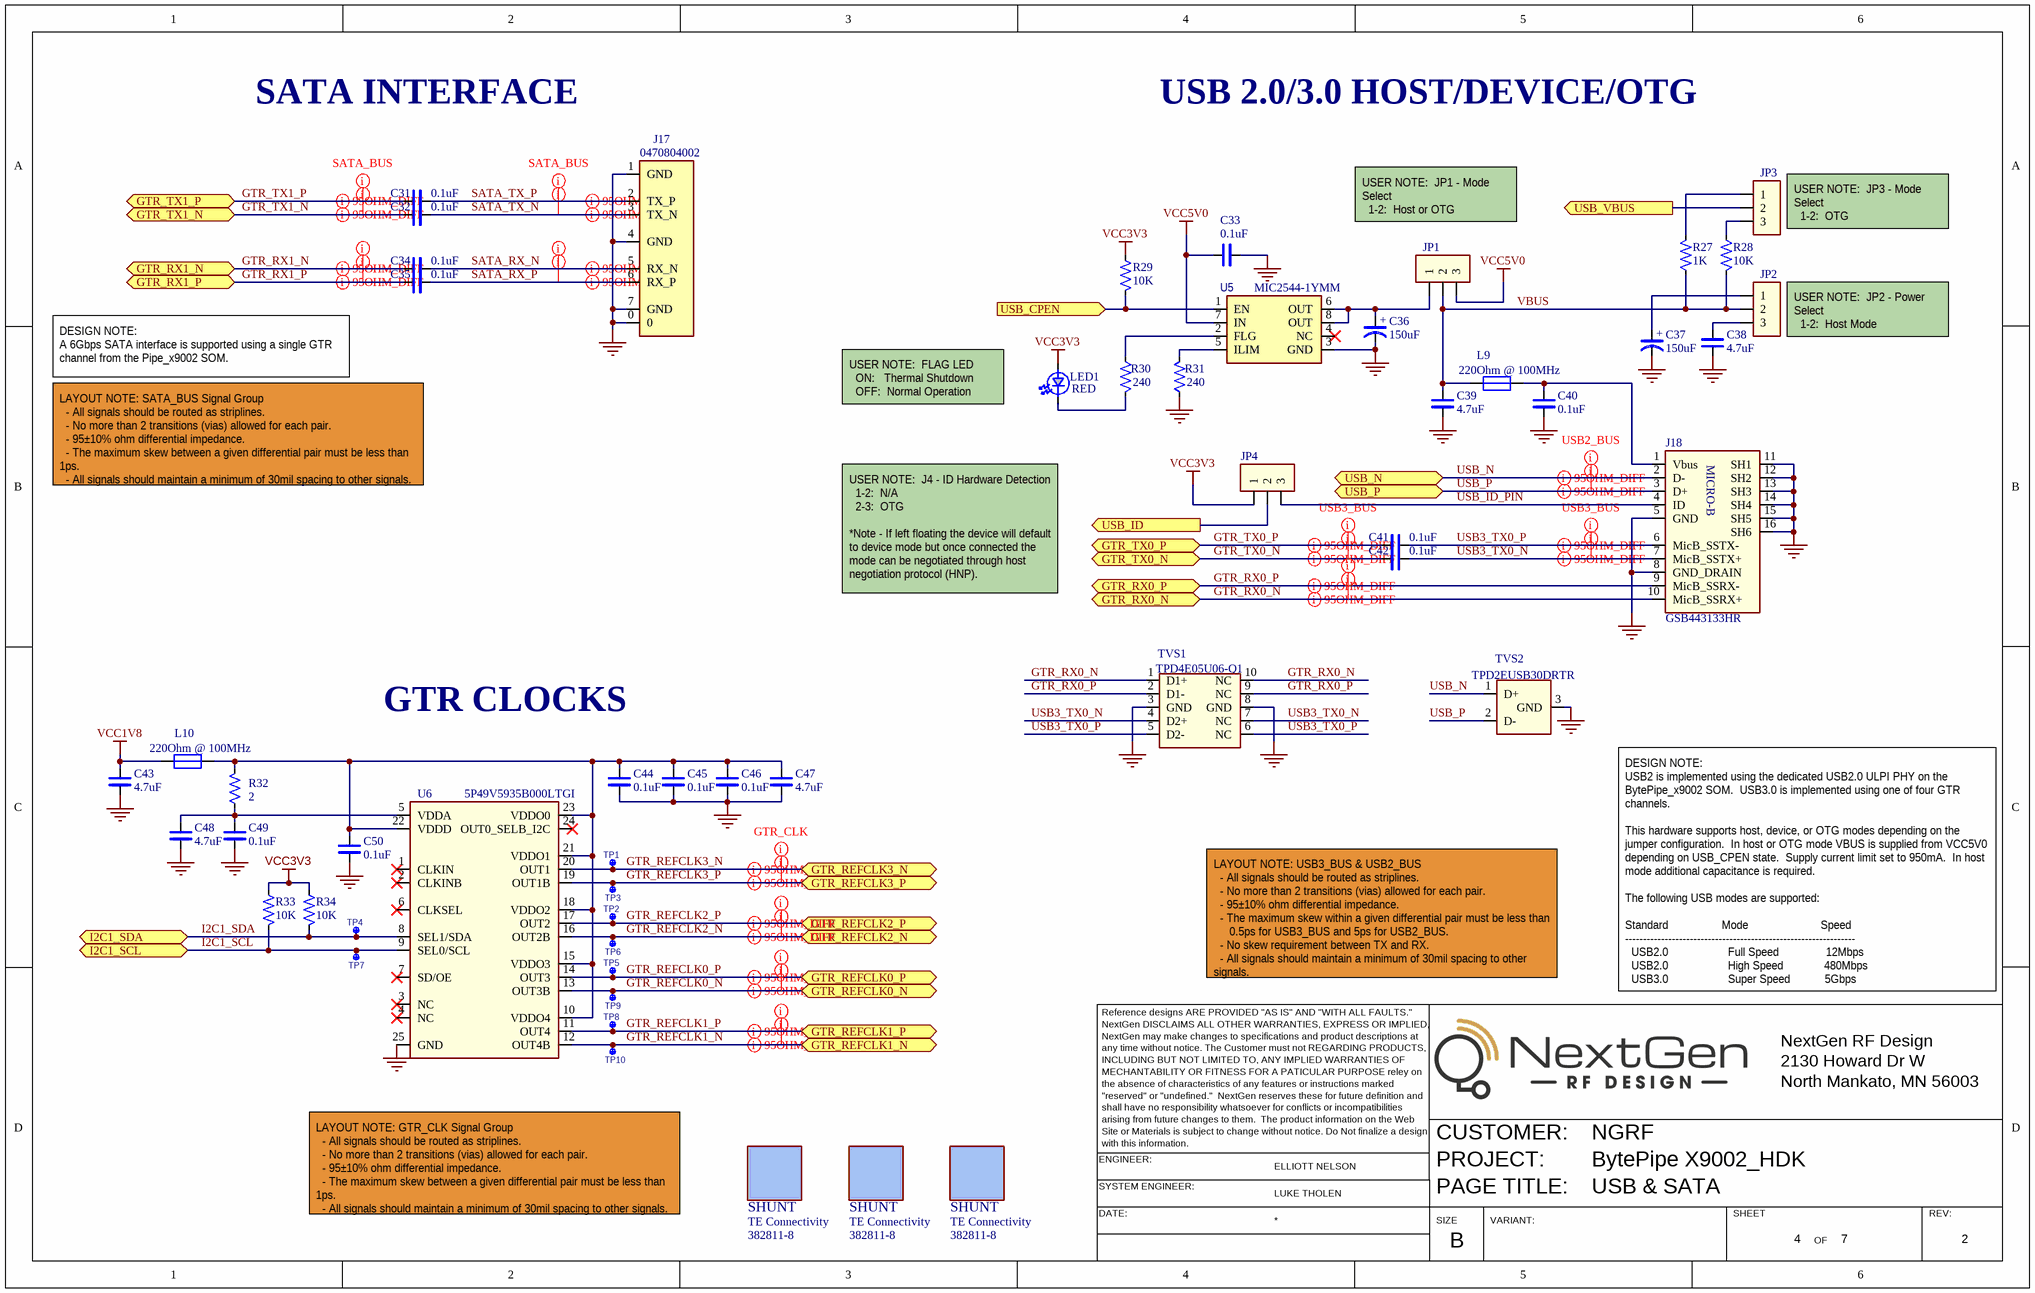
[diagram p3: 4-USB & SATA.SchDoc]

### Parts
C31  value 0.1uF  [SM/0402/CAP]  (hidden comment: CAP_CERAMIC_0402)
C32  value 0.1uF  [SM/0402/CAP]  (hidden comment: CAP_CERAMIC_0402)
C33  value 0.1uF  [SM/0402/CAP]  (hidden comment: CAP_CERAMIC_0402)
C34  value 0.1uF  [SM/0402/CAP]  (hidden comment: CAP_CERAMIC_0402)
C35  value 0.1uF  [SM/0402/CAP]  (hidden comment: CAP_CERAMIC_0402)
C36  value 150uF  [SM/CAP/TANT-D_A]  (hidden comment: TANT-D)
C37  value 150uF  [SM/CAP/TANT-D_A]  (hidden comment: TANT-D)
C38  value 4.7uF  [SM/0402/CAP]  (hidden comment: CAP_CERAMIC_0402)
C39  value 4.7uF  [SM/0402/CAP]  (hidden comment: CAP_CERAMIC_0402)
C40  value 0.1uF  [SM/0402/CAP]  (hidden comment: CAP_CERAMIC_0402)
C41  value 0.1uF  [SM/0402/CAP]  (hidden comment: CAP_CERAMIC_0402)
C42  value 0.1uF  [SM/0402/CAP]  (hidden comment: CAP_CERAMIC_0402)
C43  value 4.7uF  [SM/0402/CAP]  (hidden comment: CAP_CERAMIC_0402)
C44  value 0.1uF  [SM/0402/CAP]  (hidden comment: CAP_CERAMIC_0402)
C45  value 0.1uF  [SM/0402/CAP]  (hidden comment: CAP_CERAMIC_0402)
C46  value 0.1uF  [SM/0402/CAP]  (hidden comment: CAP_CERAMIC_0402)
C47  value 4.7uF  [SM/0402/CAP]  (hidden comment: CAP_CERAMIC_0402)
C48  value 4.7uF  [SM/0402/CAP]  (hidden comment: CAP_CERAMIC_0402)
C49  value 0.1uF  [SM/0402/CAP]  (hidden comment: CAP_CERAMIC_0402)
C50  value 0.1uF  [SM/0402/CAP]  (hidden comment: CAP_CERAMIC_0402)
J17  value 0470804002  [SM/CON/MLX/SATA/0470804002]  (hidden comment: CON_MOLEX_0470804002)
J18  value GSB443133HR  [SM/CON/USB3.1/MICRO B]  (hidden comment: CON_USB_3.1_MICRO-B_RA)
JP1  CON_100SP_1X3P_038H  [CON/100SP/1X3P]  (value not drawn)
JP2  CON_100SP_1X3P_038H  [CON/100SP/1X3P]  (value not drawn)
JP3  CON_100SP_1X3P_038H  [CON/100SP/1X3P]  (value not drawn)
JP4  CON_100SP_1X3P_038H  [CON/100SP/1X3P]  (value not drawn)
L9  value 220Ohm @ 100MHz  [SM/0603]  (hidden comment: FERRITE_0603_A)
L10  value 220Ohm @ 100MHz  [SM/0603]  (hidden comment: FERRITE_0603_A)
LED1  value RED  [SM/LED_0603]  (hidden comment: LED_0603)
R27  value 1K  [SM/0402/RES]  (hidden comment: RES_0402_A)
R28  value 10K  [SM/0402/RES]  (hidden comment: RES_0402_A)
R29  value 10K  [SM/0402/RES]  (hidden comment: RES_0402_A)
R30  value 240  [SM/0402/RES]  (hidden comment: RES_0402_A)
R31  value 240  [SM/0402/RES]  (hidden comment: RES_0402_A)
R32  value 2  [SM/0402/RES]  (hidden comment: RES_0402_A)
R33  value 10K  [SM/0402/RES]  (hidden comment: RES_0402_A)
R34  value 10K  [SM/0402/RES]  (hidden comment: RES_0402_A)
S1  SHUNT  OEM NAME: TE Connectivity  OEM#: 382811-8
S2  SHUNT  OEM NAME: TE Connectivity  OEM#: 382811-8
S3  SHUNT  OEM NAME: TE Connectivity  OEM#: 382811-8
TP1  TESTPOINT_030  [SM/TESTPOINT/30MIL]  (value not drawn)  (no BOM)
TP2  TESTPOINT_030  [SM/TESTPOINT/30MIL]  (value not drawn)  (no BOM)
TP3  TESTPOINT_030  [SM/TESTPOINT/30MIL]  (value not drawn)  (no BOM)
TP4  TESTPOINT_030  [SM/TESTPOINT/30MIL]  (value not drawn)  (no BOM)
TP5  TESTPOINT_030  [SM/TESTPOINT/30MIL]  (value not drawn)  (no BOM)
TP6  TESTPOINT_030  [SM/TESTPOINT/30MIL]  (value not drawn)  (no BOM)
TP7  TESTPOINT_030  [SM/TESTPOINT/30MIL]  (value not drawn)  (no BOM)
TP8  TESTPOINT_030  [SM/TESTPOINT/30MIL]  (value not drawn)  (no BOM)
TP9  TESTPOINT_030  [SM/TESTPOINT/30MIL]  (value not drawn)  (no BOM)
TP10  TESTPOINT_030  [SM/TESTPOINT/30MIL]  (value not drawn)  (no BOM)
TVS1  value TPD4E05U06-Q1  [SM/DFN10/2.5X1MM_A]  (hidden comment: TVS_TPD4E05U06_2.5mmX1mm)
TVS2  value TPD2EUSB30DRTR  [SM/SOT3_A]  (hidden comment: TVS_TPD2EUSB30DRTR_SOT3)
U5  value MIC2544-1YMM  [SM/MSOP8_A]  (hidden comment: IC_MIC2544-1YMM_MSOP-8)
U6  value 5P49V5935B000LTGI  [SM/LGA24/4X4/0.5LS_A]  (hidden comment: IC_5P49V5935_LGA-24)

### Ports
GTR_REFCLK0_N (bidir), GTR_REFCLK0_P (bidir), GTR_REFCLK1_N (bidir), GTR_REFCLK1_P (bidir), GTR_REFCLK2_N (bidir), GTR_REFCLK2_P (bidir), GTR_REFCLK3_N (bidir), GTR_REFCLK3_P (bidir), GTR_RX0_N (bidir), GTR_RX0_P (bidir), GTR_RX1_N (bidir), GTR_RX1_P (bidir), GTR_TX0_N (bidir), GTR_TX0_P (bidir), GTR_TX1_N (bidir), GTR_TX1_P (bidir), I2C1_SCL (bidir), I2C1_SDA (bidir), USB_CPEN (in), USB_ID (out), USB_N (bidir), USB_P (bidir), USB_VBUS (out)

### Nets
GND: C33.2(N2) C36.2(N) C37.2(N) C38.2(N2) C39.2(N2) C40.2(N2) C43.2(N2) C44.2(N2) C45.2(N2) C46.2(N2) C47.2(N2) C48.2(N2) C49.2(N2) C50.2(N2) J17.0 J17.1(GND) J17.4(GND) J17.7(GND) J18.5(GND) J18.8(GND_DRAIN) J18.11(SH1) J18.12(SH2) J18.13(SH3) J18.14(SH4) J18.15(SH5) J18.16(SH6) R31.2 TVS1.3(GND) TVS1.8(GND) TVS2.3(GND) U5.3(GND) U6.25(GND)
VCC1V8: C43.1(N1) L10.1(PIN1)
VCC3V3: JP4.1 LED1.2(A) R29.1 R33.1 R34.1
VCC5V0: C33.1(N1) JP1.3 U5.7(IN)
GTR_REFCLK0_N: TP9.1(N1) U6.13(OUT3B) ; port GTR_REFCLK0_N
GTR_REFCLK0_P: TP5.1(N1) U6.14(OUT3) ; port GTR_REFCLK0_P
GTR_REFCLK1_N: TP10.1(N1) U6.12(OUT4B) ; port GTR_REFCLK1_N
GTR_REFCLK1_P: TP8.1(N1) U6.11(OUT4) ; port GTR_REFCLK1_P
GTR_REFCLK2_N: TP6.1(N1) U6.16(OUT2B) ; port GTR_REFCLK2_N
GTR_REFCLK2_P: TP2.1(N1) U6.17(OUT2) ; port GTR_REFCLK2_P
GTR_REFCLK3_N: TP1.1(N1) U6.20(OUT1) ; port GTR_REFCLK3_N
GTR_REFCLK3_P: TP3.1(N1) U6.19(OUT1B) ; port GTR_REFCLK3_P
GTR_RX0_N: J18.10(MicB_SSRX+) TVS1.1(D1+) TVS1.10(NC) ; port GTR_RX0_N
GTR_RX0_P: J18.9(MicB_SSRX-) TVS1.2(D1-) TVS1.9(NC) ; port GTR_RX0_P
GTR_RX1_N: C34.1(N1) ; port GTR_RX1_N
GTR_RX1_P: C35.1(N1) ; port GTR_RX1_P
GTR_TX0_N: C42.1(N1) ; port GTR_TX0_N
GTR_TX0_P: C41.1(N1) ; port GTR_TX0_P
GTR_TX1_N: C32.1(N1) ; port GTR_TX1_N
GTR_TX1_P: C31.1(N1) ; port GTR_TX1_P
I2C1_SCL: R33.2 TP7.1(N1) U6.9(SEL0/SCL) ; port I2C1_SCL
I2C1_SDA: R34.2 TP4.1(N1) U6.8(SEL1/SDA) ; port I2C1_SDA
SATA_RX_N: C34.2(N2) J17.5(RX_N)
SATA_RX_P: C35.2(N2) J17.6(RX_P)
SATA_TX_N: C32.2(N2) J17.3(TX_N)
SATA_TX_P: C31.2(N2) J17.2(TX_P)
USB3_TX0_N: C42.2(N2) J18.7(MicB_SSTX+) TVS1.4(D2+) TVS1.7(NC)
USB3_TX0_P: C41.2(N2) J18.6(MicB_SSTX-) TVS1.5(D2-) TVS1.6(NC)
USB_CPEN: R29.2 U5.1(EN) ; port USB_CPEN
USB_ID: JP4.2 ; port USB_ID
USB_ID_PIN: J18.4(ID) JP4.3
USB_N: J18.2(D-) TVS2.1(D+) ; port USB_N
USB_P: J18.3(D+) TVS2.2(D-) ; port USB_P
USB_VBUS: JP3.2 ; port USB_VBUS
VBUS: C39.1(N1) JP1.2 JP2.2 L9.1(PIN1) R27.1 R28.2
NetC36_1: C36.1(+) JP1.1 U5.6(OUT) U5.8(OUT)
NetC37_1: C37.1(+) JP2.1
NetC38_1: C38.1(N1) JP2.3
NetC40_1: C40.1(N1) J18.1(Vbus) L9.2(PIN2)
NetC44_1: C44.1(N1) C45.1(N1) C46.1(N1) C47.1(N1) C50.1(N1) L10.2(PIN2) R32.1 U6.10(VDDO4) U6.15(VDDO3) U6.18(VDDO2) U6.21(VDDO1) U6.22(VDDD) U6.23(VDDO0)
NetC48_1: C48.1(N1) C49.1(N1) R32.2 U6.5(VDDA)
NetJP3_1: JP3.1 R27.2
NetJP3_3: JP3.3 R28.1
NetLED1_1: LED1.1(C) R30.1
NetR30_2: R30.2 U5.2(FLG)
NetR31_1: R31.1 U5.5(ILIM)

Not connected (* = marked no-connect by the designer): U5 4(NC)*; U6 1(CLKIN)* 2(CLKINB)* 3(NC)* 4(NC)* 6(CLKSEL)* 7(SD/OE)* 24(OUT0_SELB_I2C)*

### Layout directives
net class USB3_BUS: GTR_RX0_N, GTR_RX0_P, GTR_TX0_N, GTR_TX0_P, USB3_TX0_N, USB3_TX0_P
net class USB2_BUS: USB_N, USB_P
differential pair; Impedance: 90 Ohms; differential pair class 95OHM_DIFF: GTR_REFCLK0_N, GTR_REFCLK0_P, GTR_REFCLK1_N, GTR_REFCLK1_P, GTR_REFCLK2_N, GTR_REFCLK2_P, GTR_REFCLK3_N, GTR_REFCLK3_P, GTR_RX0_N, GTR_RX0_P, GTR_RX1_N, GTR_RX1_P, GTR_TX0_N, GTR_TX0_P, GTR_TX1_N, GTR_TX1_P, SATA_RX_N, SATA_RX_P, SATA_TX_N, SATA_TX_P, USB3_TX0_N, USB3_TX0_P, USB_N, USB_P
net class SATA_BUS: GTR_RX1_N, GTR_RX1_P, GTR_TX1_N, GTR_TX1_P, SATA_RX_N, SATA_RX_P, SATA_TX_N, SATA_TX_P
net class GTR_CLK: GTR_REFCLK0_N, GTR_REFCLK0_P, GTR_REFCLK1_N, GTR_REFCLK1_P, GTR_REFCLK2_N, GTR_REFCLK2_P, GTR_REFCLK3_N, GTR_REFCLK3_P

### Notes on the sheet
- SATA INTERFACE
- USB 2.0/3.0 HOST/DEVICE/OTG
- USER NOTE:  JP1 - Mode Select
  1-2:  Host or OTG
  2-3:  Device
- (near JP3) USER NOTE:  JP3 - Mode Select
  1-2:  OTG
  2-3:  Device or Host
- DESIGN NOTE:
  A 6Gbps SATA interface is supported using a single GTR channel from the Pipe_x9002 SOM.
- (near JP2) USER NOTE:  JP2 - Power Select
  1-2:  Host Mode
  2-3:  Device or OTG
- USER NOTE:  FLAG LED
  ON:   Thermal Shutdown
  OFF:  Normal Operation
- LAYOUT NOTE: SATA_BUS Signal Group
  - All signals should be routed as striplines.
  - No more than 2 transitions (vias) allowed for each pair.
  - 95±10% ohm differential impedance.
  - The maximum skew between a given differential pair must be less than 1ps.
  - All signals should maintain a minimum of 30mil spacing to other signals.
- USER NOTE:  J4 - ID Hardware Detection
  1-2:  N/A
  2-3:  OTG
  *Note - If left floating the device will default to device mode but once connected the mode can be negotiated through host negotiation protocol (HNP).
- GTR CLOCKS
- LAYOUT NOTE: USB3_BUS & USB2_BUS
  - All signals should be routed as striplines.
  - No more than 2 transitions (vias) allowed for each pair.
  - 95±10% ohm differential impedance.
  - The maximum skew within a given differential pair must be less than
  0.5ps for USB3_BUS and 5ps for USB2_BUS.
  - No skew requirement between TX and RX.
  - All signals should maintain a minimum of 30mil spacing to other signals.
- Reference designs ARE PROVIDED "AS IS" AND "WITH ALL FAULTS."
- NextGen DISCLAIMS ALL OTHER WARRANTIES, EXPRESS OR IMPLIED,
- NextGen may make changes to specifications and product descriptions at
- DESIGN NOTE:
  USB2 is implemented using the dedicated USB2.0 ULPI PHY on the BytePipe_x9002 SOM.  USB3.0 is implemented using one of four GTR channels.
  This hardware supports host, device, or OTG modes depending on the jumper configuration.  In host or OTG mode VBUS is supplied from VCC5V0 depending on USB_CPEN state.  Supply current limit set to 950mA.  In host mode additional capacitance is required.
  The following USB modes are supported:
  Standard                 Mode                       Speed
  ----------------------------------------------------------------
  USB2.0                   Full Speed               12Mbps
  USB2.0                   High Speed             480Mbps
  USB3.0                   Super Speed           5Gbps
- NextGen RF Design
- any time without notice. The Customer must not REGARDING PRODUCTS,
- INCLUDING BUT NOT LIMITED TO, ANY IMPLIED WARRANTIES OF
- MECHANTABILITY OR FITNESS FOR A PATICULAR PURPOSE reley on
- "reserved" or "undefined."  NextGen reserves these for future definition and
- the absence of characteristics of any features or instructions marked
- shall have no responsibility whatsoever for conflicts or incompatibilities
- 2130 Howard Dr W
- North Mankato, MN 56003
- ENGINEER:
- Site or Materials is subject to change without notice. Do Not finalize a design
- with this information.
- arising from future changes to them.  The product information on the Web
- ELLIOTT NELSON
- CUSTOMER:
- PROJECT:
- LAYOUT NOTE: GTR_CLK Signal Group
  - All signals should be routed as striplines.
  - No more than 2 transitions (vias) allowed for each pair.
  - 95±10% ohm differential impedance.
  - The maximum skew between a given differential pair must be less than 1ps.
  - All signals should maintain a minimum of 30mil spacing to other signals.
- SYSTEM ENGINEER:
- DATE:
- LUKE THOLEN
- SIZE
- PAGE TITLE:
- VARIANT:
- SHEET
- OF
- REV:
- B
- (in symbol CON_USB_3.1_MICRO-B_RA) MICRO-B

### Library data of the parts
C31-C35 C40-C42 C44-C46 C49 C50 = CAP_CERAMIC_0402: as C24 on sheet 3-RF Frontend; VOLT: 25V
C36 C37 = CAP_TANT-D: CAP TANT 150UF 20% 10V 2917; OEM#: T491D157M010AT; OEM NAME: KEMET; VOLTS: 10V
C38 C39 C43 C47 C48 = CAP_CERAMIC_0402: as C1 on sheet 2-SOM Interface; VOLT: 10V
J17 = CON_MOLEX_0470804002: 7 Position SATA Plug Connector Solder Surface Mount, Right Angle; OEM NAME: MOLEX; OEM#: 0470804002
J18 = CON_USB_3.1_MICRO-B_RA: CONN RCPT USB3.1 MICRO B SMD R/A; OEM NAME: Amphenol ICC; OEM#: GSB443133HR
JP1-JP4 = CON_100SP_1X3P_038H: PIN HEADER, SINGLE ROW 3 PIN STR; OEM#: PH1-03-UA; OEM NAME: Adam Tech; VALUE: PH1-03-UA
L9 L10 = FERRITE_0603_A: 120 Ohms @ 100MHz 1 Power Line Ferrite Bead 0603 (1608 Metric) 3A 25mOhm; OEM#: BLM18SG121TN1D; OEM NAME: Murata Electronics
LED1 = LED_0603: LED-0603; OEM#: LS Q976-NR-1; OEM NAME: OSRAM
R27 = RES_0402_A: RES SMD 1K OHM 1% 1/10W 0402; OEM#: ERJ-2RKF1001X; OEM NAME: Panasonic; TOL: ±1%
R28 R29 R33 R34 = RES_0402_A: OEM#: ERJ-2RKF1002X; OEM NAME: Panasonic; TOL: ±1%
R30 R31 = RES_0402_A: RES SMD 240 OHM 1% 1/10W 0402; OEM#: ERJ-2RKF2400X; OEM NAME: Panasonic; TOL: 1%
R32 = RES_0402_A: RES 2 OHM 1% 1/10W 0402 SMD; OEM#: ERJ-U02F2R00X; OEM NAME: Panasonic; TOL: ±1%
S1-S3 = BOM_COMPONENT_NO-FOOTPRINT: VALUE: SHUNT
TVS1 = TVS_TPD4E05U06_2.5mmX1mm: TVS DIODE 5.5V 14V 10SON; OEM NAME: TI; OEM#: TPD4E05U06-Q1
TVS2 = TVS_TPD2EUSB30DRTR_SOT3: TVS DIODE 5.5V 8V SOT3; OEM NAME: Texas Instruments; WATT: 45; OEM#: TPD2EUSB30DRTR
U5 = IC_MIC2544-1YMM_MSOP-8: Power Switch/Driver 1:1 N-Channel 1.5A 8-MSOP; OEM NAME: MICROCHIP; OEM#: MIC2544-1YMM
U6 = IC_5P49V5935_LGA-24: IC Programable Clock Generator; OEM NAME: Renesas; OEM#: 5P49V5935B000LTGI